# Altium project fitkit4_fpga.PrjPcb
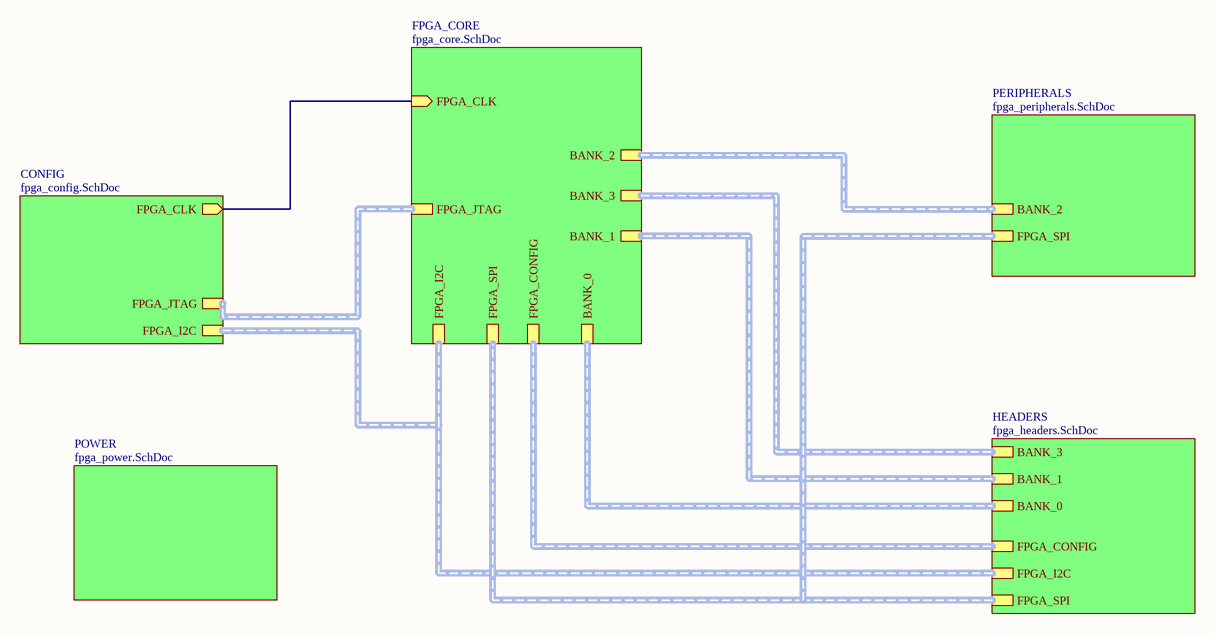
[diagram p0: fpga_board.SchDoc]
6 sheets, 79 parts. Net scope: hierarchical (ports join the sheet entries above them; power ports are global).
Board file: fpga_board.PcbDoc
Sheets:
  fpga_board.SchDoc
    FPGA_CORE = fpga_core.SchDoc
    POWER = fpga_power.SchDoc
    CONFIG = fpga_config.SchDoc
    PERIPHERALS = fpga_peripherals.SchDoc
    HEADERS = fpga_headers.SchDoc

## Sheet fpga_board.SchDoc
size A4

### Sub-sheets
CONFIG = fpga_config.SchDoc: FPGA_JTAG (harness FPGA_JTAG), FPGA_I2C (harness FPGA_I2C), FPGA_CLK (out)
FPGA_CORE = fpga_core.SchDoc: BANK_2 (harness BANK_2), BANK_3 (harness BANK_3), BANK_1 (harness BANK_1), BANK_0 (harness BANK_0), FPGA_I2C (harness FPGA_I2C), FPGA_SPI (harness FPGA_SPI), FPGA_JTAG (harness FPGA_JTAG), FPGA_CONFIG (harness FPGA_CONFIG), FPGA_CLK (in)
HEADERS = fpga_headers.SchDoc: FPGA_I2C (harness FPGA_I2C), BANK_1 (harness BANK_1), FPGA_SPI (harness FPGA_SPI), BANK_3, FPGA_CONFIG, BANK_0
PERIPHERALS = fpga_peripherals.SchDoc: FPGA_SPI, BANK_2
POWER = fpga_power.SchDoc: no entries

### Nets
PT23A: sheet FPGA_CORE/FPGA_CLK, sheet CONFIG/FPGA_CLK

### Buses and harness runs
harness sheet CONFIG/FPGA_I2C = sheet FPGA_CORE/FPGA_I2C = sheet HEADERS/FPGA_I2C
harness sheet CONFIG/FPGA_JTAG = sheet FPGA_CORE/FPGA_JTAG
harness sheet FPGA_CORE/BANK_0 = sheet HEADERS/BANK_0
harness sheet FPGA_CORE/BANK_1 = sheet HEADERS/BANK_1
harness sheet FPGA_CORE/BANK_2 = sheet PERIPHERALS/BANK_2
harness sheet FPGA_CORE/BANK_3 = sheet HEADERS/BANK_3
harness sheet FPGA_CORE/FPGA_CONFIG = sheet HEADERS/FPGA_CONFIG
harness sheet FPGA_CORE/FPGA_SPI = sheet HEADERS/FPGA_SPI = sheet PERIPHERALS/FPGA_SPI

## Sheet fpga_core.SchDoc
size A4
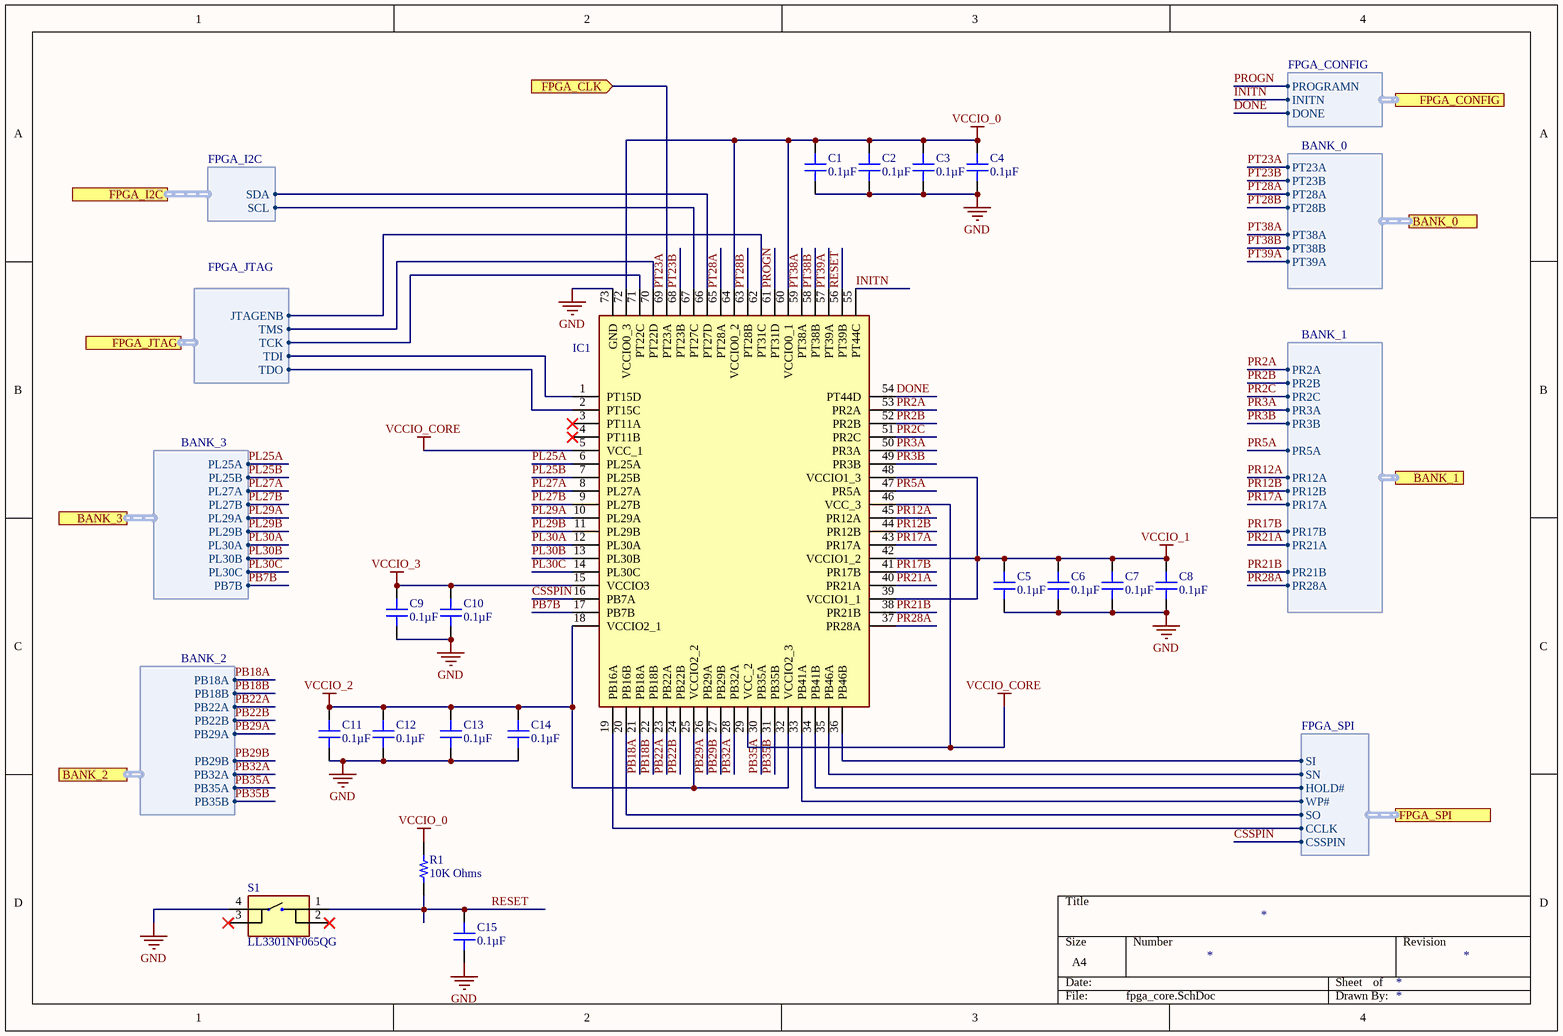
[diagram p1: fpga_core.SchDoc]

### Parts
C1  0.1µF  [CAP 0603_1608]
C2  0.1µF  [CAP 0603_1608]
C3  0.1µF  [CAP 0603_1608]
C4  0.1µF  [CAP 0603_1608]
C5  0.1µF  [CAP 0603_1608]
C6  0.1µF  [CAP 0603_1608]
C7  0.1µF  [CAP 0603_1608]
C8  0.1µF  [CAP 0603_1608]
C9  0.1µF  [CAP 0603_1608]
C10  0.1µF  [CAP 0603_1608]
C11  0.1µF  [CAP 0603_1608]
C12  0.1µF  [CAP 0603_1608]
C13  0.1µF  [CAP 0603_1608]
C14  0.1µF  [CAP 0603_1608]
C15  0.1µF  [CAP 0603_1608]
IC1  LCMXO3D-9400HC-6SG72C  [QFN50P1000X1000X90-73N-D]  (value not drawn)
R1  10K Ohms  [RES 0603_1608]
S1  LL3301NF065QG  [LL3301NF065QG]

### Ports
BANK_0 (harness BANK_0), BANK_1 (harness BANK_1), BANK_2 (harness BANK_2), BANK_3 (harness BANK_3), FPGA_CLK (in), FPGA_CONFIG (harness FPGA_CONFIG), FPGA_I2C (harness FPGA_I2C), FPGA_JTAG (harness FPGA_JTAG), FPGA_SPI (harness FPGA_SPI)

### Harnesses
BANK_3: PB7B, PL30C, PL30B, PL30A, PL29B, PL29A, PL27B, PL27A, PL25B, PL25A
BANK_1: PR2A, PR2B, PR2C, PR3A, PR3B, PR5A, PR12A, PR12B, PR17A, PR17B, PR21A, PR21B, PR28A
BANK_0: PT23A, PT23B, PT28A, PT28B, PT38A, PT38B, PT39A
BANK_2: PB35B, PB35A, PB32A, PB29B, PB29A, PB22B, PB22A, PB18B, PB18A
FPGA_SPI: SI, SN, SO, CCLK, CSSPIN, HOLD#, WP#
FPGA_I2C: SDA, SCL
FPGA_JTAG: JTAGENB, TMS, TCK, TDI, TDO
FPGA_CONFIG: PROGRAMN, INITN, DONE

### Nets
GND: C1.1 C2.1 C3.1 C4.1 C5.1 C6.1 C7.1 C8.1 C9.1 C10.1 C11.1 C12.1 C13.1 C14.1 C15.1 IC1.73(GND) S1.4
VCCIO_0: C1.2 C2.2 C3.2 C4.2 IC1.60(VCCIO0_1) IC1.64(VCCIO0_2) IC1.72(VCCIO0_3) R1.2
VCCIO_1: C5.2 C6.2 C7.2 C8.2 IC1.39(VCCIO1_1) IC1.42(VCCIO1_2) IC1.48(VCCIO1_3)
VCCIO_2: C11.2 C12.2 C13.2 C14.2 IC1.18(VCCIO2_1) IC1.25(VCCIO2_2) IC1.32(VCCIO2_3)
VCCIO_3: C9.2 C10.2 IC1.15(VCCIO3)
VCCIO_CORE: IC1.5(VCC_1) IC1.29(VCC_2) IC1.46(VCC_3)
CSSPIN: IC1.16(PB7A) ; port FPGA_SPI.CSSPIN
DONE: IC1.54(PT44D) ; port FPGA_CONFIG.DONE
INITN: IC1.55(PT44C) ; port FPGA_CONFIG.INITN
PB7B: IC1.17(PB7B) ; port BANK_3.PB7B
PB18A: IC1.21(PB18A) ; port BANK_2.PB18A
PB18B: IC1.22(PB18B) ; port BANK_2.PB18B
PB22A: IC1.23(PB22A) ; port BANK_2.PB22A
PB22B: IC1.24(PB22B) ; port BANK_2.PB22B
PB29A: IC1.26(PB29A) ; port BANK_2.PB29A
PB29B: IC1.27(PB29B) ; port BANK_2.PB29B
PB32A: IC1.28(PB32A) ; port BANK_2.PB32A
PB35A: IC1.30(PB35A) ; port BANK_2.PB35A
PB35B: IC1.31(PB35B) ; port BANK_2.PB35B
PL25A: IC1.6(PL25A) ; port BANK_3.PL25A
PL25B: IC1.7(PL25B) ; port BANK_3.PL25B
PL27A: IC1.8(PL27A) ; port BANK_3.PL27A
PL27B: IC1.9(PL27B) ; port BANK_3.PL27B
PL29A: IC1.10(PL29A) ; port BANK_3.PL29A
PL29B: IC1.11(PL29B) ; port BANK_3.PL29B
PL30A: IC1.12(PL30A) ; port BANK_3.PL30A
PL30B: IC1.13(PL30B) ; port BANK_3.PL30B
PL30C: IC1.14(PL30C) ; port BANK_3.PL30C
PR2A: IC1.53(PR2A) ; port BANK_1.PR2A
PR2B: IC1.52(PR2B) ; port BANK_1.PR2B
PR2C: IC1.51(PR2C) ; port BANK_1.PR2C
PR3A: IC1.50(PR3A) ; port BANK_1.PR3A
PR3B: IC1.49(PR3B) ; port BANK_1.PR3B
PR5A: IC1.47(PR5A) ; port BANK_1.PR5A
PR12A: IC1.45(PR12A) ; port BANK_1.PR12A
PR12B: IC1.44(PR12B) ; port BANK_1.PR12B
PR17A: IC1.43(PR17A) ; port BANK_1.PR17A
PR17B: IC1.41(PR17B) ; port BANK_1.PR17B
PR21A: IC1.40(PR21A) ; port BANK_1.PR21A
PR21B: IC1.38(PR21B) ; port BANK_1.PR21B
PR28A: IC1.37(PR28A) ; port BANK_1.PR28A
PROGN: IC1.61(PT31D) ; port FPGA_CONFIG.PROGRAMN
PT23A: IC1.69(PT23A) ; port FPGA_CLK, port BANK_0.PT23A
PT23B: IC1.68(PT23B) ; port BANK_0.PT23B
PT28A: IC1.65(PT28A) ; port BANK_0.PT28A
PT28B: IC1.63(PT28B) ; port BANK_0.PT28B
PT38A: IC1.59(PT38A) ; port BANK_0.PT38A
PT38B: IC1.58(PT38B) ; port BANK_0.PT38B
PT39A: IC1.57(PT39A) ; port BANK_0.PT39A
RESET: C15.2 IC1.56(PT39B) R1.1 S1.1
NetIC1_1: IC1.1(PT15D) ; port FPGA_JTAG.TDI
NetIC1_2: IC1.2(PT15C) ; port FPGA_JTAG.TDO
NetIC1_19: IC1.19(PB16A) ; port FPGA_SPI.CCLK
NetIC1_20: IC1.20(PB16B) ; port FPGA_SPI.SO
NetIC1_33: IC1.33(PB41A) ; port FPGA_SPI.WP#
NetIC1_34: IC1.34(PB41B) ; port FPGA_SPI.HOLD#
NetIC1_35: IC1.35(PB46A) ; port FPGA_SPI.SN
NetIC1_36: IC1.36(PB46B) ; port FPGA_SPI.SI
NetIC1_62: IC1.62(PT31C) ; port FPGA_JTAG.JTAGENB
NetIC1_66: IC1.66(PT27D) ; port FPGA_I2C.SDA
NetIC1_67: IC1.67(PT27C) ; port FPGA_I2C.SCL
NetIC1_70: IC1.70(PT22D) ; port FPGA_JTAG.TMS
NetIC1_71: IC1.71(PT22C) ; port FPGA_JTAG.TCK

Not connected (* = marked no-connect by the designer): IC1 3(PT11A)* 4(PT11B)*; S1 2* 3*

### Library data of the parts
C1-C15 = CS0603KRX7R7BB104: CAP CER 0.1UF 16V X7R 0603; Manufacturer: Yageo; Tolerance: ±10%; Part Number: CS0603KRX7R7BB104; Value: 0.1µF; Applications: Boardflex Sensitive; Capacitance: 0.1µF; ComponentLink1Description: Datasheet; ComponentLink1URL: http://www.yageo.com/NewPortal/yageodocoutput?fileName=/pdf/MLCC/UPY-ST_NPOX7R_16V-to-3KV_5.pdf; ComponentLink2Description: DigiKey Link; ComponentLink2URL: http://digikey.com/product-detail/en/yageo/CS0603KRX7R7BB104/311-3560-1-ND/7648487; Device Package: 0603 (1608 Metric); Features: Soft Termination; LastUpdated: 02.09.2020 1:03:36; Lifecycle Status: Active; Minimum Order: 1; Mounting Type: Surface Mount, MLCC; Operating Temperature: -55°C ~ 125°C; Package / Case: 0603 (1608 Metric); Packaging: TapeAndReel; PartId: 2286; Part Status: Active; Price: 0.02; Series: CS; Size / Dimension: 0.063" L x 0.031" W (1.60mm x 0.80mm); Supplier 1: DigiKey; Supplier Part Number 1: 311-3560-1-ND; Temperature Coefficient: X7R; Thickness (Max): 0.037" (0.95mm); Voltage - Rated: 16V
IC1 = LCMXO3D-9400HC-6SG72C: Integrated Circuit; Manufacturer_Name: Lattice Semiconductor; Datasheet Link: http://www.latticesemi.com/Products/FPGAandCPLD/MachXO3D; Height: 0.9mm; Manufacturer_Part_Number: LCMXO3D-9400HC-6SG72C; Mouser Part Number: 842-O3D9400HC6SG72C; Mouser Price/Stock: https://www.mouser.co.uk/ProductDetail/Lattice/LCMXO3D-9400HC-6SG72C?qs=P1JMDcb91o5zlo%2FfseWNjQ%3D%3D
R1 = CRCW0603470RJNEAHP: RES SMD 470 OHM 5% 1/4W 0603; Manufacturer: Vishay Dale; Power (Watts): 0.25W, 1/4W; Resistance: 470 Ohms; Temperature Coefficient: ±200ppm/°C; Part Number: CRCW0603470RJNEAHP; Value: 10K Ohms; ComponentLink1Description: Datasheet; ComponentLink1URL: http://www.vishay.com/docs/20043/crcwhpe3.pdf; ComponentLink2Description: DigiKey Link; ComponentLink2URL: http://digikey.com/product-detail/en/vishay-dale/CRCW0603470RJNEAHP/541-470SACT-ND/2222809; Composition: Thick Film; Device Package: 0603 (1608 Metric); Features: Automotive AEC-Q200, Pulse Withstanding; Height - Seated (Max): 0.022" (0.55mm); LastUpdated: 02.09.2020 1:09:49; Lifecycle Status: Active; Minimum Order: 1; Number of Terminations: 2; Operating Temperature: -55°C ~ 155°C; Package / Case: 0603 (1608 Metric); Packaging: TapeAndReel; PartId: 21320; Part Status: Active; Price: 0.02; Ratings: AEC-Q200; Series: CRCW-HP; Size / Dimension: 0.063" L x 0.033" W (1.60mm x 0.85mm); Supplier Device Package: 0603; Tolerance: ±5%; Supplier 1: Farnell; Supplier Part Number 1: 3495224
S1 = LL3301NF065QG: Switch; Manufacturer_Name: E-Switch; Datasheet Link: http://spec_sheets.e-switch.com/specs/P090002.pdf; Height: 4mm; Manufacturer_Part_Number: LL3301NF065QG; Mouser Part Number: 612-LL3301NF065QG; Mouser Price/Stock: https://www.mouser.co.uk/ProductDetail/E-Switch/LL3301NF065QG/?qs=QtyuwXswaQiWhwgY68YTTw%3D%3D

## Sheet fpga_power.SchDoc
size A4
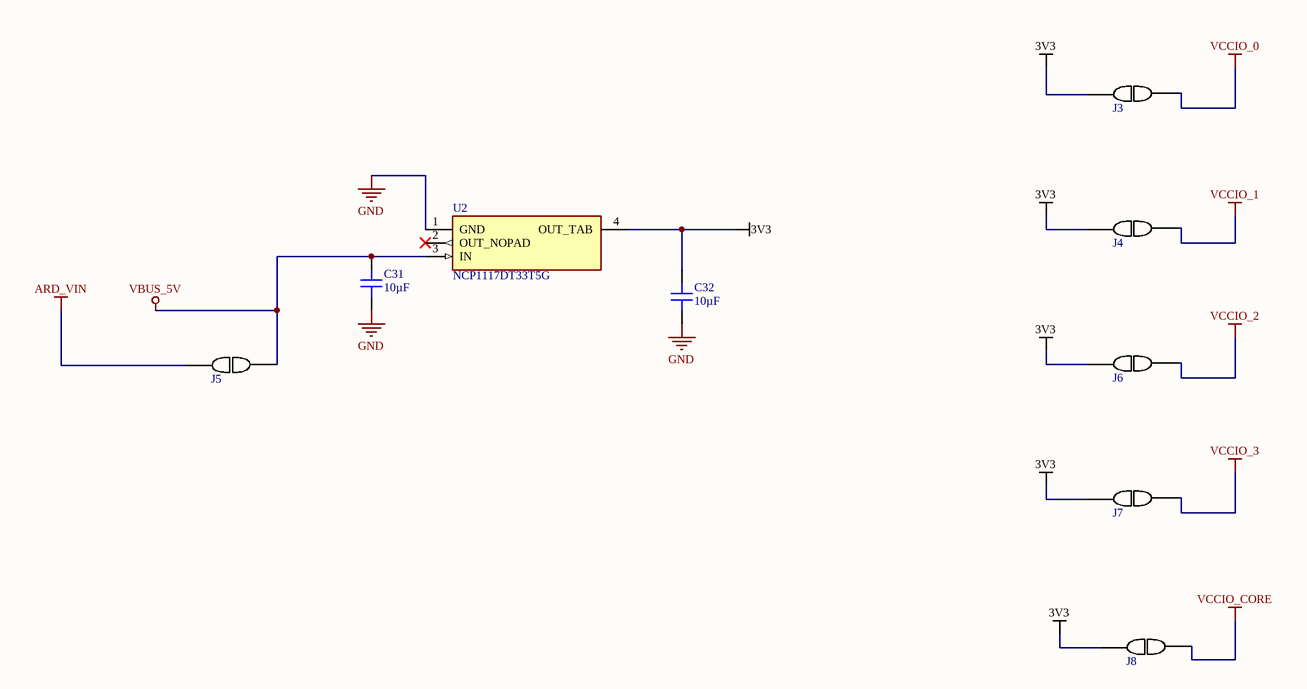
[diagram p2: fpga_power.SchDoc]

### Parts
C31  10µF  [CAP 0603_1608]
C32  10µF  [CAP 0603_1608]
J3  103185-2  [TE_103185-2]  (value not drawn)
J4  103185-2  [TE_103185-2]  (value not drawn)
J5  103185-2  [TE_103185-2]  (value not drawn)
J6  103185-2  [TE_103185-2]  (value not drawn)
J7  103185-2  [TE_103185-2]  (value not drawn)
J8  103185-2  [TE_103185-2]  (value not drawn)
U2  NCP1117DT33T5G  [TO229P990X238-4N]

### Nets
3V3: C32.1 J3.1 J4.1 J6.1 J7.1 J8.1 U2.4(OUT_TAB)
ARD_VIN: J5.2
GND: C31.1 C32.2 U2.1(GND)
VBUS_5V: C31.2 J5.1 U2.3(IN)
VCCIO_0: J3.2
VCCIO_1: J4.2
VCCIO_2: J6.2
VCCIO_3: J7.2
VCCIO_CORE: J8.2

Not connected (* = marked no-connect by the designer): U2 2(OUT_NOPAD)*

### Library data of the parts
C31 C32 = GRT188R61C106KE13D: CAP CER 10UF 16V X5R 0603; Manufacturer: Murata Electronics; Tolerance: ±10%; Part Number: GRT188R61C106KE13D; Value: 10µF; Applications: Automotive; Capacitance: 10µF; ComponentLink1Description: Datasheet; ComponentLink1URL: https://search.murata.co.jp/Ceramy/image/img/A01X/G101/ENG/GRT188R61C106KE13-01.pdf; ComponentLink2Description: DigiKey Link; ComponentLink2URL: http://digikey.com/product-detail/en/murata-electronics/GRT188R61C106KE13D/490-12317-1-ND/5417018; Device Package: 0603 (1608 Metric); LastUpdated: 02.09.2020 1:03:11; Lifecycle Status: Active; Minimum Order: 1; Mounting Type: Surface Mount, MLCC; Operating Temperature: -55°C ~ 85°C; Package / Case: 0603 (1608 Metric); Packaging: TapeAndReel; PartId: 14922; Part Status: Active; Price: 0.10; Ratings: AEC-Q200; Series: GRT; Size / Dimension: 0.063" L x 0.031" W (1.60mm x 0.80mm); Supplier 1: DigiKey; Supplier Part Number 1: 490-12317-1-ND; Temperature Coefficient: X5R; Thickness (Max): 0.035" (0.90mm); Voltage - Rated: 16V
J3-J8 = 103185-2: 02 MODII HDR SRST B/A .100CL; Package: None; Price: None; Value: *; MP: 103185-2; Availability: Unavailable
U2 = NCP1117DT33T5G: Integrated Circuit; Manufacturer_Name: ON Semiconductor; Datasheet Link: http://www.onsemi.com/pub/Collateral/NCP1117-D.PDF; Height: 2.38mm; Manufacturer_Part_Number: NCP1117DT33T5G; Mouser Part Number: 863-NCP1117DT33T5G; Mouser Price/Stock: https://www.mouser.co.uk/ProductDetail/ON-Semiconductor/NCP1117DT33T5G/?qs=Gev%252BmEvV0ibY9yFNc3ZYyw%3D%3D; Arrow Part Number: NCP1117DT33T5G; Arrow Price/Stock: https://www.arrow.com/en/products/ncp1117dt33t5g/on-semiconductor

## Sheet fpga_config.SchDoc
size A4
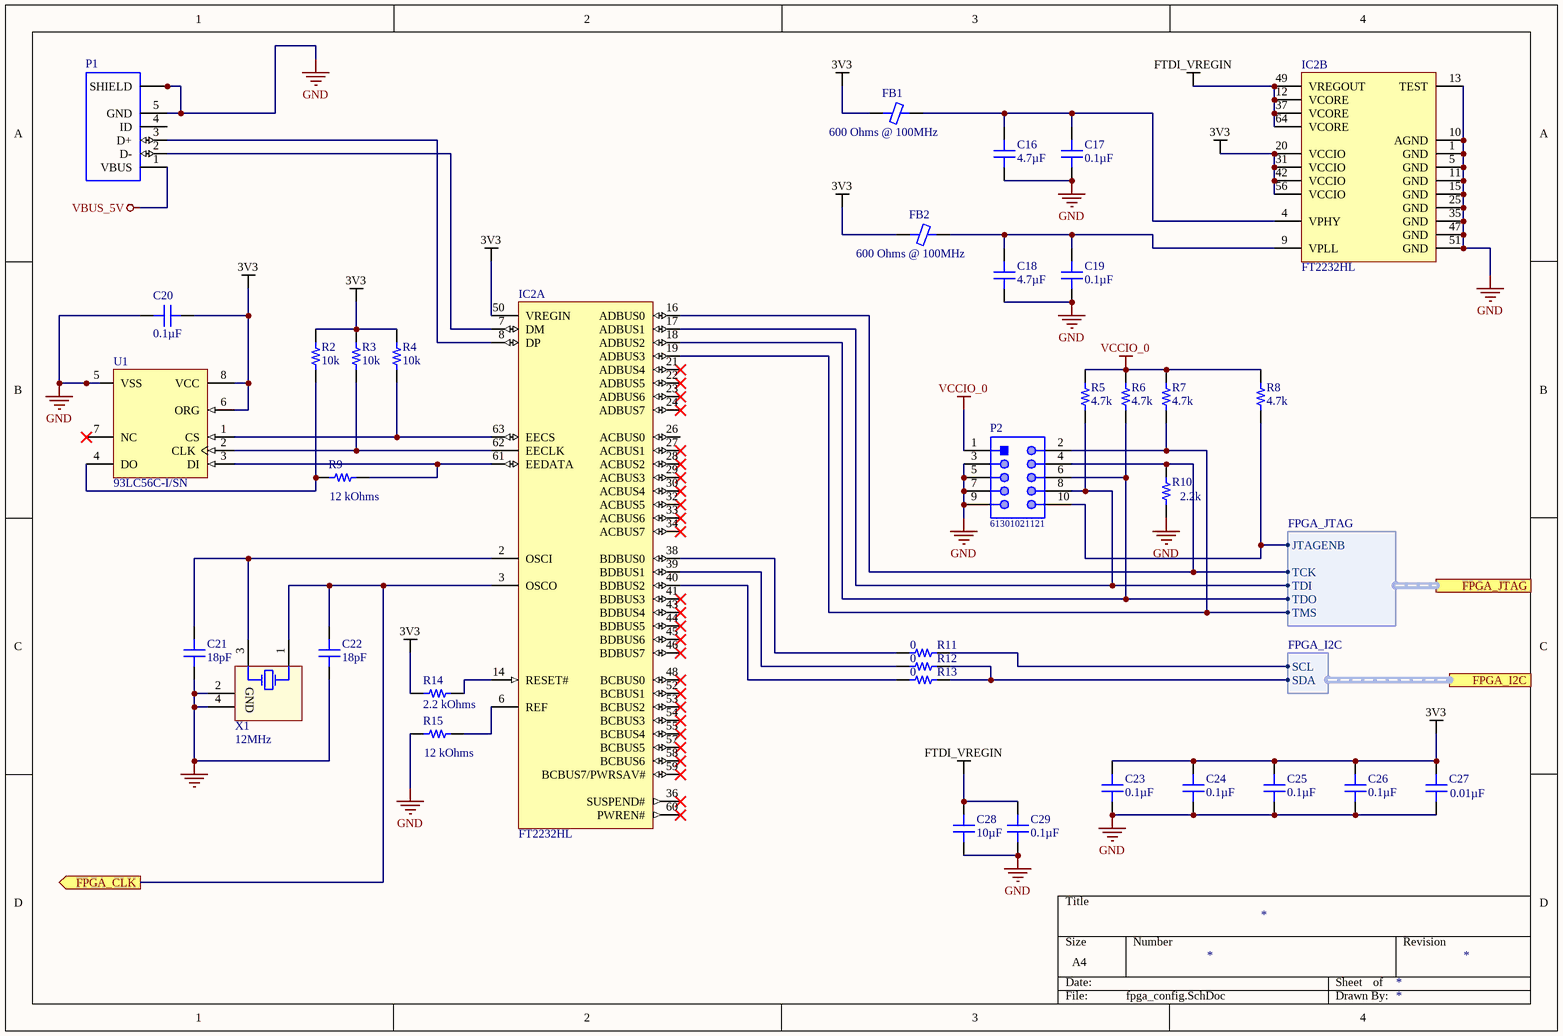
[diagram p3: fpga_config.SchDoc]

### Parts
C16  4.7µF  [CAP 0603_1608]
C17  0.1µF  [CAP 0603_1608]
C18  4.7µF  [CAP 0603_1608]
C19  0.1µF  [CAP 0603_1608]
C20  0.1µF  [CAP 0603_1608]
C21  18pF  [CAP 0603_1608]
C22  18pF  [CAP 0603_1608]
C23  0.1µF  [CAP 0603_1608]
C24  0.1µF  [CAP 0603_1608]
C25  0.1µF  [CAP 0603_1608]
C26  0.1µF  [CAP 0603_1608]
C27  0.01µF  [CAP 0603_1608]
C28  10µF  [CAP 0603_1608]
C29  0.1µF  [CAP 0603_1608]
FB1  600 Ohms @ 100MHz  [FER 0603_1608]
FB2  600 Ohms @ 100MHz  [FER 0603_1608]
IC2  FT2232HL  [FTDI-LQFP-64_L]  (parts A,B of 2)
P1  47346-0001  [MOLEX_47346-0001]  (value not drawn)
P2  61301021121  [61301021121]
R2  10k  [RES 0603_1608]
R3  10k  [RES 0603_1608]
R4  10k  [RES 0603_1608]
R5  4.7k  [RES 0603_1608]
R6  4.7k  [RES 0603_1608]
R7  4.7k  [RES 0603_1608]
R8  4.7k  [RES 0603_1608]
R9  12 kOhms  [RES 0603_1608]
R10  2.2k  [RES 0603_1608]
R11  0  [RES 0603_1608]
R12  0  [RES 0603_1608]
R13  0  [RES 0603_1608]
R14  2.2 kOhms  [RES 0603_1608]
R15  12 kOhms  [RES 0603_1608]
U1  93LC56C-I/SN  [SOIC-SN8_L]
X1  12MHz  [ABRA-ABMM2-4_V]

### Ports
FPGA_CLK (out), FPGA_I2C (harness FPGA_I2C), FPGA_JTAG (harness FPGA_JTAG)

### Harnesses
FPGA_JTAG: JTAGENB, TCK, TDI, TDO, TMS
FPGA_I2C: SCL, SDA

### Nets
3V3: C20.1 C23.2 C24.2 C25.2 C26.2 C27.2 FB1.1 FB2.1 IC2.20(VCCIO) IC2.31(VCCIO) IC2.42(VCCIO) IC2.50(VREGIN) IC2.56(VCCIO) R2.2 R3.2 R4.2 R14.1 U1.6(ORG) U1.8(VCC)
FTDI_VREGIN: C28.2 C29.2 IC2.12(VCORE) IC2.37(VCORE) IC2.49(VREGOUT) IC2.64(VCORE)
GND: C16.1 C17.1 C18.1 C19.1 C20.2 C21.1 C22.1 C23.1 C24.1 C25.1 C26.1 C27.1 C28.1 C29.1 IC2.1(GND) IC2.5(GND) IC2.10(AGND) IC2.11(GND) IC2.13(TEST) IC2.15(GND) IC2.25(GND) IC2.35(GND) IC2.47(GND) IC2.51(GND) P1.5(GND) P1.SH1(SHIELD) P1.SH2(SHIELD) P1.SH3(SHIELD) P1.SH4(SHIELD) P1.SH5(SHIELD) P1.SH6(SHIELD) P2.3 P2.5 P2.7 P2.9 R10.1 R15.1 U1.5(VSS) X1.2(GND) X1.4(GND)
VBUS_5V: P1.1(VBUS)
VCCIO_0: P2.1 R5.2 R6.2 R7.2 R8.2
PT23A: C22.2 IC2.3(OSCO) X1.1(X1) ; port FPGA_CLK
NetC16_2: C16.2 C17.2 FB1.2 IC2.4(VPHY)
NetC18_2: C18.2 C19.2 FB2.2 IC2.9(VPLL)
NetC21_2: C21.2 IC2.2(OSCI) X1.3(X2)
NetIC1_1: IC2.17(ADBUS1) P2.8 R5.1 ; port FPGA_JTAG.TDI
NetIC1_2: IC2.18(ADBUS2) P2.6 R6.1 ; port FPGA_JTAG.TDO
NetIC1_62: P2.10 R8.1 ; port FPGA_JTAG.JTAGENB
NetIC1_66: R12.2 R13.2 ; port FPGA_I2C.SDA
NetIC1_67: R11.2 ; port FPGA_I2C.SCL
NetIC1_70: IC2.19(ADBUS3) P2.2 R7.1 ; port FPGA_JTAG.TMS
NetIC1_71: IC2.16(ADBUS0) P2.4 R10.2 ; port FPGA_JTAG.TCK
NetIC2_6: IC2.6(REF) R15.2
NetIC2_7: IC2.7(DM) P1.2(D-)
NetIC2_8: IC2.8(DP) P1.3(D+)
NetIC2_14: IC2.14(RESET#) R14.2
NetIC2_38: IC2.38(BDBUS0) R11.1
NetIC2_39: IC2.39(BDBUS1) R12.1
NetIC2_40: IC2.40(BDBUS2) R13.1
NetIC2_61: IC2.61(EEDATA) R9.2 U1.3(DI)
NetIC2_62: IC2.62(EECLK) R3.1 U1.2(CLK)
NetIC2_63: IC2.63(EECS) R4.1 U1.1(CS)
NetR2_1: R2.1 R9.1 U1.4(DO)

Not connected (* = marked no-connect by the designer): IC2 21(ADBUS4)* 22(ADBUS5)* 23(ADBUS6)* 24(ADBUS7)* 26(ACBUS0) 27(ACBUS1)* 28(ACBUS2)* 29(ACBUS3)* 30(ACBUS4)* 32(ACBUS5)* 33(ACBUS6)* 34(ACBUS7)* 36(SUSPEND#)* 41(BDBUS3)* 43(BDBUS4)* 44(BDBUS5)* 45(BDBUS6)* 46(BDBUS7)* 48(BCBUS0)* 52(BCBUS1)* 53(BCBUS2)* 54(BCBUS3)* 55(BCBUS4)* 57(BCBUS5)* 58(BCBUS6)* 59(BCBUS7/PWRSAV#)* 60(PWREN#)*; P1 4(ID); U1 7(NC)*

### Library data of the parts
C16 C18 = LMK107BJ475KA-T: CAP CER 4.7UF 10V X5R 0603; Manufacturer: Taiyo Yuden; Tolerance: ±10%; Part Number: LMK107BJ475KA-T; Value: 4.7µF; Applications: General Purpose; Capacitance: 4.7µF; ComponentLink1Description: Datasheet; ComponentLink1URL: https://ds.yuden.co.jp/TYCOMPAS/ut/detail?pn=LMK107BJ475KA-T  &u=M; ComponentLink2Description: DigiKey Link; ComponentLink2URL: http://digikey.com/product-detail/en/taiyo-yuden/LMK107BJ475KA-T/587-1441-1-ND/1004072; Device Package: 0603 (1608 Metric); LastUpdated: 02.09.2020 1:03:36; Lifecycle Status: Active; Minimum Order: 1; Mounting Type: Surface Mount, MLCC; Operating Temperature: -55°C ~ 85°C; Package / Case: 0603 (1608 Metric); Packaging: TapeAndReel; PartId: 2244; Part Status: Active; Price: 0.03; Series: M; Size / Dimension: 0.063" L x 0.031" W (1.60mm x 0.80mm); Supplier 1: DigiKey; Supplier Part Number 1: 587-1441-1-ND; Temperature Coefficient: X5R; Thickness (Max): 0.035" (0.90mm); Voltage - Rated: 10V
C17 C19 C20 C23-C26 C29 = C0603C104K5RAC7411: CAP CER 0.1UF 50V X7R 0603; Manufacturer: KEMET; Tolerance: ±10%; Part Number: C0603C104K5RAC7411; Value: 0.1µF; Applications: Bypass, Decoupling; Capacitance: 0.1µF; ComponentLink1Description: Datasheet; ComponentLink1URL: https://api.kemet.com/component-edge/download/datasheet/C0603C104K5RAC7411.pdf; ComponentLink2Description: DigiKey Link; ComponentLink2URL: http://digikey.com/product-detail/en/kemet/C0603C104K5RAC7411/399-7374-2-ND/3317013; Device Package: 0603 (1608 Metric); LastUpdated: 02.09.2020 1:03:36; Lifecycle Status: Active; Minimum Order: 15000; Mounting Type: Surface Mount, MLCC; Operating Temperature: -55°C ~ 125°C; Package / Case: 0603 (1608 Metric); Packaging: TapeAndReel; PartId: 2233; Part Status: Active; Price: 0.02; Series: SMD Comm X7R; Size / Dimension: 0.063" L x 0.031" W (1.60mm x 0.80mm); Supplier 1: DigiKey; Supplier Part Number 1: 399-7374-2-ND; Temperature Coefficient: X7R; Thickness (Max): 0.035" (0.90mm); Voltage - Rated: 50V
C21 C22 = VJ0603A180FXQCW1BC: CAP CER 18PF 10V C0G/NP0 0603; Manufacturer: Vishay Vitramon; Temperature Coefficient: C0G, NP0; Tolerance: ±1%; Part Number: VJ0603A180FXQCW1BC; Value: 18pF; Applications: General Purpose; Capacitance: 18pF; ComponentLink1Description: Datasheet; ComponentLink1URL: https://www.vishay.com/docs/28548/vjw1bcbascomseries.pdf; ComponentLink2Description: DigiKey Link; ComponentLink2URL: http://digikey.com/product-detail/en/vishay-vitramon/VJ0603A180FXQCW1BC/720-1660-1-ND/8324080; Device Package: 0603 (1608 Metric); LastUpdated: 02.09.2020 1:03:27; Lifecycle Status: Active; Minimum Order: 1; Mounting Type: Surface Mount, MLCC; Operating Temperature: -55°C ~ 125°C; Package / Case: 0603 (1608 Metric); Packaging: TapeAndReel; PartId: 7094; Part Status: Active; Price: 0.04; Series: VJ; Size / Dimension: 0.063" L x 0.031" W (1.60mm x 0.80mm); Supplier 1: DigiKey; Supplier Part Number 1: 720-1660-1-ND; Thickness (Max): 0.034" (0.87mm); Voltage - Rated: 10V
C27 = C0603C103KARACAUTO: CAP CER 0.01UF 250V X7R 0603; Manufacturer: KEMET; Tolerance: ±10%; Part Number: C0603C103KARACAUTO; Value: 0.01µF; Applications: Automotive, Bypass, Decoupling; Capacitance: 0.01µF; ComponentLink1Description: Datasheet; ComponentLink1URL: https://api.kemet.com/component-edge/download/datasheet/C0603C103KARACAUTO.pdf; ComponentLink2Description: DigiKey Link; ComponentLink2URL: http://digikey.com/product-detail/en/kemet/C0603C103KARACAUTO/399-17960-1-ND/9084030; Device Package: 0603 (1608 Metric); LastUpdated: 02.09.2020 1:03:10; Lifecycle Status: Active; Minimum Order: 1; Mounting Type: Surface Mount, MLCC; Operating Temperature: -55°C ~ 125°C; Package / Case: 0603 (1608 Metric); Packaging: TapeAndReel; PartId: 15195; Part Status: Active; Price: 0.25; Ratings: AEC-Q200; Series: SMD Auto X7R; Size / Dimension: 0.063" L x 0.031" W (1.60mm x 0.80mm); Supplier 1: DigiKey; Supplier Part Number 1: 399-17960-1-ND; Temperature Coefficient: X7R; Thickness (Max): 0.034" (0.87mm); Voltage - Rated: 250V
C28 = GRM188R60J106ME47D: CAP CER 10UF 6.3V X5R 0603; Manufacturer: Murata Electronics; Tolerance: ±20%; Part Number: GRM188R60J106ME47D; Value: 10µF; Applications: General Purpose; Capacitance: 10µF; ComponentLink1Description: Datasheet; ComponentLink1URL: https://www.murata.com/~/media/webrenewal/support/library/catalog/products/capacitor/mlcc/c02e.ashx?la=en-us; ComponentLink2Description: DigiKey Link; ComponentLink2URL: http://digikey.com/product-detail/en/murata-electronics/GRM188R60J106ME47D/490-3896-1-ND/965938; Device Package: 0603 (1608 Metric); LastUpdated: 02.09.2020 1:03:35; Lifecycle Status: Active; Minimum Order: 1; Mounting Type: Surface Mount, MLCC; Operating Temperature: -55°C ~ 85°C; Package / Case: 0603 (1608 Metric); Packaging: TapeAndReel; PartId: 2351; Part Status: Active; Price: 0.03; Series: GRM; Size / Dimension: 0.063" L x 0.031" W (1.60mm x 0.80mm); Supplier 1: DigiKey; Supplier Part Number 1: 490-3896-1-ND; Temperature Coefficient: X5R; Thickness (Max): 0.035" (0.90mm); Voltage - Rated: 6.3V
FB1 FB2 = BLM18AG601SN1D: FERRITE BEAD 600 OHM 0603 1LN; Manufacturer: Murata Electronics; Current Rating (Max): 500mA; DC Resistance (DCR) (Max): 380mOhm; Number of Lines: 1; Part Number: BLM18AG601SN1D; ComponentLink1Description: Datasheet; ComponentLink1URL: https://www.murata.com/en-us/products/productdata/8796738650142/ENFA0003.pdf; ComponentLink2Description: DigiKey Link; ComponentLink2URL: http://digikey.com/product-detail/en/murata-electronics/BLM18AG601SN1D/490-1014-1-ND/584462; Device Package: 0603 (1608 Metric); Height (Max): 0.037" (0.95mm); Impedance @ Frequency: 600 Ohms @ 100MHz; LastUpdated: 02.09.2020 1:18:18; Lifecycle Status: Active; Minimum Order: 1; Mounting Type: Surface Mount; Operating Temperature: -55°C ~ 125°C; Package / Case: 0603 (1608 Metric); Packaging: TapeAndReel; PartId: 848; Part Status: Active; Price: 0.02; Series: EMIFIL®, BLM18; Size / Dimension: 0.063" L x 0.032" W (1.60mm x 0.80mm); Supplier 1: DigiKey; Supplier Part Number 1: 490-1014-1-ND; Value: 600 Ohms @ 100MHz
IC2 = CMP-2000-06287-1: Dual High Speed USB to Multipurpose UART / FIFO IC / , 3 to 3.6 V, -40 to 85 degC, 64- Pin LQFP, RoHS; Manufacturer: FTDI; Number of Channels per Chip: 2; Standard Supported: RS232,RS422,RS485; Maximum Data Rate: 480Mbit/s; Package Description: 64-Pin Low-profile Quad Flat Package, Body 10 x 10 mm, Pitch 0.5 mm; Maximum Operating Temperature: +85°C; Mounting Technology: SurfaceMount; Pin Count: 64; Package Reference: LQFP-64; Manufacturer URL: http://www.nxp.com/; Length: 10mm; Width: 10mm; Minimum Operating Temperature: -40°C; Dimensions: 10x10x1.4mm; Package Type: LQFP; Mounting Type: SurfaceMount; Datasheet URL: http://www.ftdichip.com/Support/Documents/DataSheets/ICs/DS_FT2232H.pdf; Datasheet Version: Rev. 2.5, 07/2016; Height: 1.4mm
P1 = 47346-0001: CONN RCPT 5POS MICRO USB R/A  SMD; Value: *; Supplier 1: Farnell; Supplier Part Number 1: 1568026; Supplier 2: Mouser; Supplier Part Number 2: 538-47346-0001
P2 = CMP-1502-01084-1: THT Vertical Pin Header WR-PHD, Pitch 2.54 mm, Dual Row, 10 pins; Manufacturer: Wurth Elektronik; Working Voltage: 250VAC; Pitch: 2.54mm; Contact Resistance: 20mOhm; Gender: Male; Rated Current: 3A; Withstanding Voltage: 500VAC; Pin Number: 10; Operating Temperature: -40to105degC; Mounting Technology: THT; Publisher: WurthElektronik; Manufacturer URL: http://www.we-online.de; Part Number: 61301021121; Row Number: Dual; Packaging: Bag; Orientation: Vertical; Package Reference: 61301021121; Datasheet URL: https://katalog.we-online.de/em/datasheet/6130xx21121.pdf
R2-R4 = RNCS0603BKE10K0: RES 10K OHM 0.1% 1/16W 0603; Manufacturer: Stackpole Electronics Inc; Power (Watts): 0.063W, 1/16W; Resistance: 10 kOhms; Temperature Coefficient: ±25ppm/°C; Part Number: RNCS0603BKE10K0; Value: 10k; ComponentLink1Description: Datasheet; ComponentLink1URL: https://www.seielect.com/catalog/sei-rncs_rnch.pdf; ComponentLink2Description: DigiKey Link; ComponentLink2URL: http://digikey.com/product-detail/en/stackpole-electronics-inc/RNCS0603BKE10K0/RNCS0603BKE10K0CT-ND/1800113; Composition: Thin Film; Device Package: 0603 (1608 Metric); Features: Anti-Corrosive, Automotive AEC-Q200, Moisture Resistant; Height - Seated (Max): 0.022" (0.55mm); LastUpdated: 02.09.2020 1:10:25; Lifecycle Status: Active; Minimum Order: 1; Number of Terminations: 2; Operating Temperature: -55°C ~ 155°C; Package / Case: 0603 (1608 Metric); Packaging: TapeAndReel; PartId: 4838; Part Status: Active; Price: 0.08; Ratings: AEC-Q200; Series: RNCS; Size / Dimension: 0.061" L x 0.031" W (1.55mm x 0.80mm); Supplier 1: DigiKey; Supplier Part Number 1: RNCS0603BKE10K0CT-ND; Supplier Device Package: 0603; Tolerance: ±0.1%
R5-R8 = RT0603FRE074K7L: RES SMD 4.7K OHM 1% 1/10W 0603; Manufacturer: Yageo; Power (Watts): 0.1W, 1/10W; Resistance: 4.7 kOhms; Temperature Coefficient: ±50ppm/°C; Part Number: RT0603FRE074K7L; Value: 4.7k; ComponentLink1Description: Datasheet; ComponentLink1URL: https://www.yageo.com/upload/media/product/productsearch/datasheet/rchip/PYu-RT_1-to-0.01_RoHS_L_11.pdf; ComponentLink2Description: DigiKey Link; ComponentLink2URL: http://digikey.com/product-detail/en/yageo/RT0603FRE074K7L/YAG1238CT-ND/4340591; Composition: Thin Film; Device Package: 0603 (1608 Metric); Height - Seated (Max): 0.022" (0.55mm); LastUpdated: 02.09.2020 1:10:23; Lifecycle Status: Active; Minimum Order: 1; Number of Terminations: 2; Operating Temperature: -55°C ~ 155°C; Package / Case: 0603 (1608 Metric); Packaging: TapeAndReel; PartId: 5678; Part Status: Active; Price: 0.01; Series: RT; Size / Dimension: 0.063" L x 0.031" W (1.60mm x 0.80mm); Supplier 1: DigiKey; Supplier Part Number 1: YAG1238CT-ND; Supplier Device Package: 0603; Tolerance: ±1%
R9 R15 = RMCF0603JT12K0: RES 12K OHM 5% 1/10W 0603; Manufacturer: Stackpole Electronics Inc; Power (Watts): 0.1W, 1/10W; Temperature Coefficient: ±200ppm/°C; Part Number: RMCF0603JT12K0; Value: 12 kOhms; ComponentLink1Description: Datasheet; ComponentLink1URL: https://www.seielect.com/catalog/sei-rmcf_rmcp.pdf; ComponentLink2Description: DigiKey Link; ComponentLink2URL: http://digikey.com/product-detail/en/stackpole-electronics-inc/RMCF0603JT12K0/RMCF0603JT12K0CT-ND/1943192; Composition: Thick Film; Device Package: 0603 (1608 Metric); Features: Automotive AEC-Q200; Height - Seated (Max): 0.022" (0.55mm); LastUpdated: 02.09.2020 1:10:24; Lifecycle Status: Active; Minimum Order: 1; Number of Terminations: 2; Operating Temperature: -55°C ~ 155°C; Package / Case: 0603 (1608 Metric); Packaging: CutTape; PartId: 5166; Part Status: Active; Price: 0.10; Ratings: AEC-Q200; Resistance: 12 kOhms; Series: RMCF; Size / Dimension: 0.061" L x 0.031" W (1.55mm x 0.80mm); Supplier 1: DigiKey; Supplier Part Number 1: RMCF0603JT12K0CT-ND; Supplier Device Package: 0603; Tolerance: ±5%
R10 = ERA-3AEB222V: RES SMD 2.2K OHM 0.1% 1/10W 0603; Manufacturer: Panasonic Electronic Components; Power (Watts): 0.1W, 1/10W; Resistance: 2.2 kOhms; Temperature Coefficient: ±25ppm/°C; Part Number: ERA-3AEB222V; Value: 2.2k; ComponentLink1Description: Datasheet; ComponentLink1URL: https://industrial.panasonic.com/cdbs/www-data/pdf/RDM0000/AOA0000C307.pdf; ComponentLink2Description: DigiKey Link; ComponentLink2URL: http://digikey.com/product-detail/en/panasonic-electronic-components/ERA-3AEB222V/P2.2KDBCT-ND/1466060; Composition: Thin Film; Device Package: 0603 (1608 Metric); Features: Automotive AEC-Q200; Height - Seated (Max): 0.022" (0.55mm); LastUpdated: 02.09.2020 1:10:23; Lifecycle Status: Active; Minimum Order: 1; Number of Terminations: 2; Operating Temperature: -55°C ~ 155°C; Package / Case: 0603 (1608 Metric); Packaging: TapeAndReel; PartId: 5547; Part Status: Active; Price: 0.04; Ratings: AEC-Q200; Series: ERA-3A; Size / Dimension: 0.063" L x 0.031" W (1.60mm x 0.80mm); Supplier 1: DigiKey; Supplier Part Number 1: P2.2KDBCT-ND; Supplier Device Package: 0603; Tolerance: ±0.1%
R11-R13 = TLRZ1JTTD: RES 0 OHM JUMPER 0603; Manufacturer: KOA Speer Electronics, Inc.; Part Number: TLRZ1JTTD; ComponentLink1Description: Datasheet; ComponentLink1URL: http://www.koaspeer.com/catimages/Products/TLRZ/TLRZ.pdf; ComponentLink2Description: DigiKey Link; ComponentLink2URL: http://digikey.com/product-detail/en/koa-speer-electronics-inc/TLRZ1JTTD/2019-TLRZ1JTTDCT-ND/9847537; Composition: Metal Element; Device Package: 0603 (1608 Metric); Features: Automotive AEC-Q200, Current Sense; Height - Seated (Max): 0.022" (0.55mm); LastUpdated: 02.09.2020 1:10:25; Lifecycle Status: Active; Minimum Order: 1; Number of Terminations: 2; Operating Temperature: -55°C ~ 170°C; Package / Case: 0603 (1608 Metric); Packaging: TapeAndReel; PartId: 4851; Part Status: Active; Price: 0.08; Ratings: AEC-Q200; Series: TLRZ; Size / Dimension: 0.063" L x 0.031" W (1.60mm x 0.80mm); Supplier 1: DigiKey; Supplier Part Number 1: 2019-TLRZ1JTTDCT-ND; Supplier Device Package: 0603; Tolerance: Jumper
R14 = ERA-3AEB222V: RES SMD 2.2K OHM 0.1% 1/10W 0603; Manufacturer: Panasonic Electronic Components; Power (Watts): 0.1W, 1/10W; Temperature Coefficient: ±25ppm/°C; Part Number: ERA-3AEB222V; Value: 2.2 kOhms; ComponentLink1Description: Datasheet; ComponentLink1URL: https://industrial.panasonic.com/cdbs/www-data/pdf/RDM0000/AOA0000C307.pdf; ComponentLink2Description: DigiKey Link; ComponentLink2URL: http://digikey.com/product-detail/en/panasonic-electronic-components/ERA-3AEB222V/P2.2KDBCT-ND/1466060; Composition: Thin Film; Device Package: 0603 (1608 Metric); Features: Automotive AEC-Q200; Height - Seated (Max): 0.022" (0.55mm); LastUpdated: 02.09.2020 1:10:23; Lifecycle Status: Active; Minimum Order: 1; Number of Terminations: 2; Operating Temperature: -55°C ~ 155°C; Package / Case: 0603 (1608 Metric); Packaging: TapeAndReel; PartId: 5547; Part Status: Active; Price: 0.04; Ratings: AEC-Q200; Resistance: 2.2 kOhms; Series: ERA-3A; Size / Dimension: 0.063" L x 0.031" W (1.60mm x 0.80mm); Supplier 1: DigiKey; Supplier Part Number 1: P2.2KDBCT-ND; Supplier Device Package: 0603; Tolerance: ±0.1%
U1 = CMP-0162-00111-1: 2K, 256x8 or 128x16-bit, 2.5V Microwire Serial EEPROM, 8-Pin SOIC 150mil, Industrial Temperature; ComponentAvailability: Unknown. Contact manufacturer to determine status.; PackageReference: SOIC-SN8; PackageVersion: revBB, Aug-2009; Code_IPC: SOIC127P600-8; PackageDescription: 8-Lead Plastic Small Outline (SN) - Narrow, 3.90mm Body [SOIC]; DatasheetVersion: revF, May-2008; Code_JEDEC: MS-012
X1 = CMP-0277-00003-1: Ceramic Surface Mount Low Profile Quartz Crystal, 8 MHz, -20 to 70 degC, 4-Pin 6 x 3.6 x 1.2 mm SMD, RoHS, 1000pcs / Reel; Manufacturer: Abracon; PartNumber: ABMM2-8.000MHZ-E2-T; ESR: 72 Ohm Max.; Frequency: 8 MHz; Shunt Capacitance C0: 7 pF Max.; Load Capacitance CL: 18 pF Typ.; ComponentLink3Description: Package Specification; PackageDescription: 4-Pin SMD, Body 6 x 3.6 mm, Pitch 4.4 mm; DatasheetVersion: Jan-13; ComponentLink1URL: http://www.abracon.com/; ComponentLink2URL: http://www.abracon.com/Resonators/ABMM2.pdf; Temperature Range: -20 to 70 degC; Mounting Technology: Surface Mount; RoHS: TRUE; ComponentLink2Description: Datasheet; ComponentLink3URL: http://www.abracon.com/Resonators/ABMM2.pdf; ComponentLink1Description: Manufacturer URL; Packing: 1000pcs / Reel

## Sheet fpga_peripherals.SchDoc: FPGA_PERIPHERALS
size A4
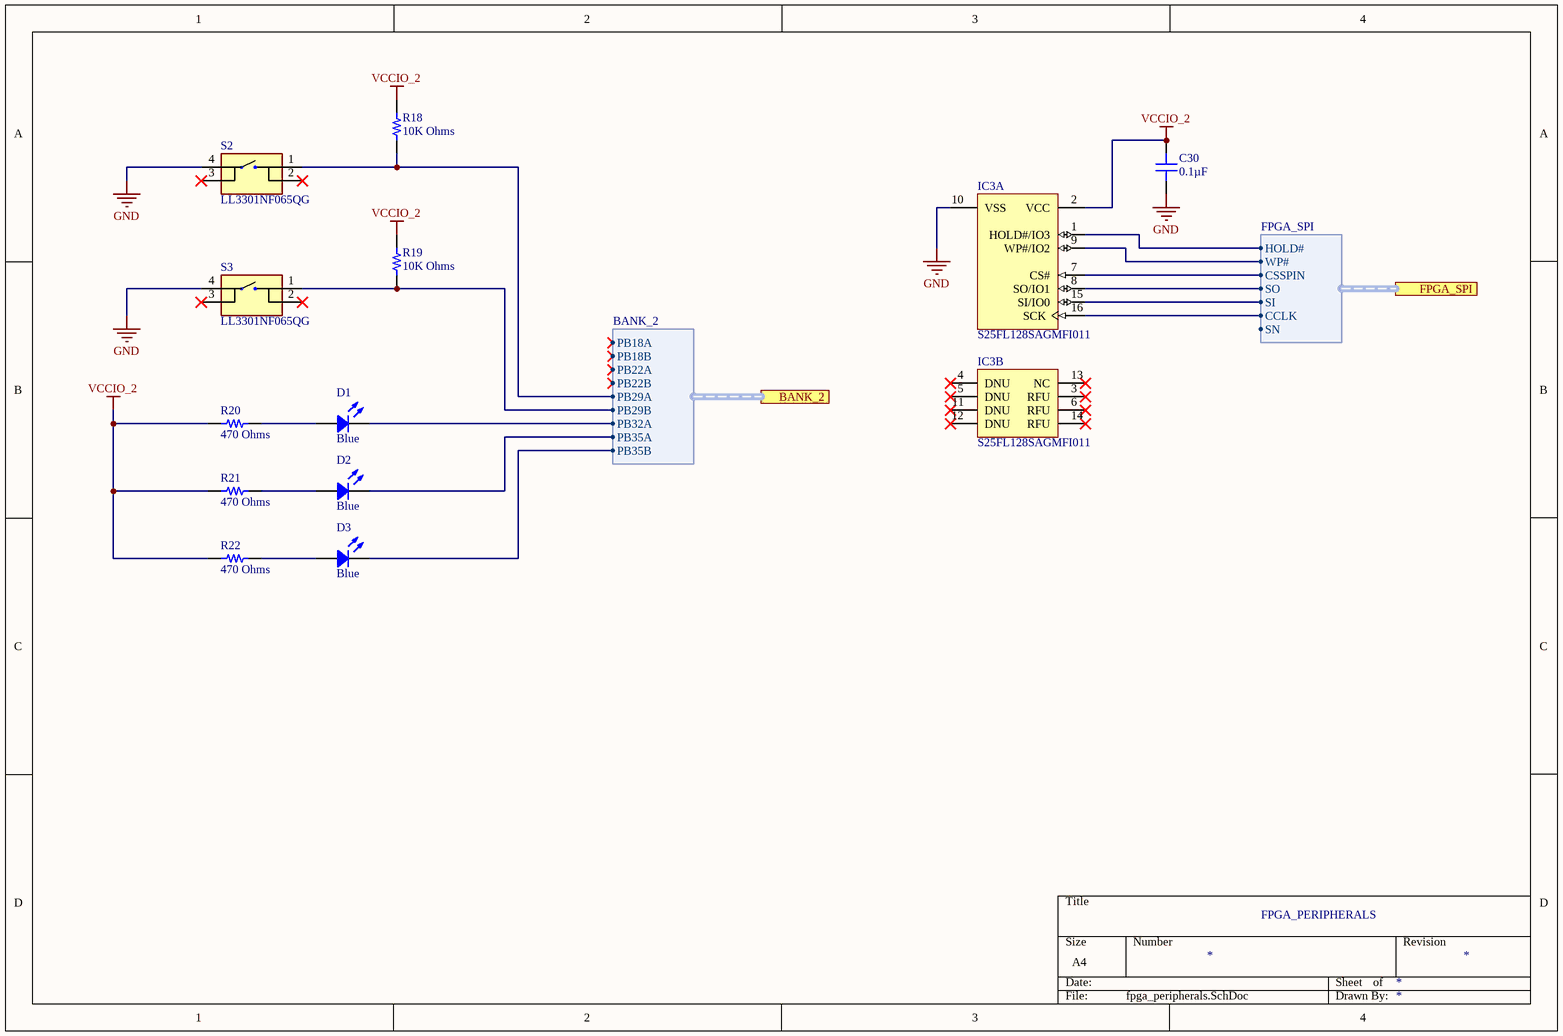
[diagram p4: fpga_peripherals.SchDoc]

### Parts
C30  0.1µF  [CAP 0603_1608]
D1  Blue  [LED 0603_1608 BLUE]
D2  Blue  [LED 0603_1608 BLUE]
D3  Blue  [LED 0603_1608 BLUE]
IC3  S25FL128SAGMFI011  [SPSN-SOIC-16_L]  (parts A,B of 2)
R18  10K Ohms  [RES 0603_1608]
R19  10K Ohms  [RES 0603_1608]
R20  470 Ohms  [RES 0603_1608]
R21  470 Ohms  [RES 0603_1608]
R22  470 Ohms  [RES 0603_1608]
S2  LL3301NF065QG  [LL3301NF065QG]
S3  LL3301NF065QG  [LL3301NF065QG]

### Ports
BANK_2 (harness BANK_2), FPGA_SPI (harness FPGA_SPI)

### Harnesses
FPGA_SPI: CCLK, CSSPIN, HOLD#, SI, SN, SO, WP#
BANK_2: PB18A, PB18B, PB22A, PB22B, PB29A, PB29B, PB32A, PB35A, PB35B

### Nets
GND: C30.1 IC3.10(VSS) S2.4 S3.4
VCCIO_2: C30.2 IC3.2(VCC) R18.2 R19.2 R20.1 R21.1 R22.1
CSSPIN: IC3.7(CS#) ; port FPGA_SPI.CSSPIN
PB29A: R18.1 S2.1 ; port BANK_2.PB29A
PB29B: R19.1 S3.1 ; port BANK_2.PB29B
PB32A: D1.2 ; port BANK_2.PB32A
PB35A: D2.2 ; port BANK_2.PB35A
PB35B: D3.2 ; port BANK_2.PB35B
NetD1_1: D1.1 R20.2
NetD2_1: D2.1 R21.2
NetD3_1: D3.1 R22.2
NetIC1_19: IC3.16(SCK) ; port FPGA_SPI.CCLK
NetIC1_20: IC3.8(SO/IO1) ; port FPGA_SPI.SO
NetIC1_33: IC3.9(WP#/IO2) ; port FPGA_SPI.WP#
NetIC1_34: IC3.1(HOLD#/IO3) ; port FPGA_SPI.HOLD#
NetIC1_36: IC3.15(SI/IO0) ; port FPGA_SPI.SI

Not connected (* = marked no-connect by the designer): IC3 3(RFU)* 4(DNU)* 5(DNU)* 6(RFU)* 11(DNU)* 12(DNU)* 13(NC)* 14(RFU)*; S2 2* 3*; S3 2* 3*

### Library data of the parts
C30 = C0603C104K5RAC7411: as C17 on sheet fpga_config; Part Number: C0603C104K5RAC7411; Value: 0.1µF; Applications: Bypass, Decoupling; Capacitance: 0.1µF; ComponentLink1Description: Datasheet; ComponentLink1URL: https://api.kemet.com/component-edge/download/datasheet/C0603C104K5RAC7411.pdf; ComponentLink2Description: DigiKey Link; ComponentLink2URL: http://digikey.com/product-detail/en/kemet/C0603C104K5RAC7411/399-7374-2-ND/3317013; Device Package: 0603 (1608 Metric); LastUpdated: 02.09.2020 1:03:36; Lifecycle Status: Active; Minimum Order: 15000; Mounting Type: Surface Mount, MLCC; Operating Temperature: -55°C ~ 125°C; Package / Case: 0603 (1608 Metric); Packaging: TapeAndReel; PartId: 2233; Part Status: Active; Price: 0.02; Series: SMD Comm X7R; Size / Dimension: 0.063" L x 0.031" W (1.60mm x 0.80mm); Supplier 1: DigiKey; Supplier Part Number 1: 399-7374-2-ND; Temperature Coefficient: X7R; Thickness (Max): 0.035" (0.90mm); Voltage - Rated: 50V
D1-D3 = VLMB1300-GS08: LED BLUE 0603 SMD; Manufacturer: Vishay Semiconductor Opto Division; Configuration: Standard; Current - Test: 20mA; Lens Color: 1.00mm; Lens Size: 1.10mm x 0.80mm; Lens Style: Rectangle with Flat Top; Millicandela Rating: 104mcd; Viewing Angle: 130°; Voltage - Forward (Vf) (Typ): 3.3V; Wavelength - Dominant: 470nm; Wavelength - Peak: 468nm; Part Number: VLMB1300-GS08; Color: Blue; ComponentLink1Description: Datasheet; ComponentLink1URL: http://www.vishay.com/docs/82437/vlmo1300.pdf; ComponentLink2Description: DigiKey Link; ComponentLink2URL: http://digikey.com/product-detail/en/vishay-semiconductor-opto-division/VLMB1300-GS08/VLMB1300-GS08CT-ND/3025485; Device Package: 0603 (1608 Metric); Height (Max): 1.00mm; LastUpdated: 02.09.2020 1:20:26; Lifecycle Status: Active; Minimum Order: 1; Mounting Type: Surface Mount; Package / Case: 0603 (1608 Metric); Packaging: TapeAndReel; PartId: 785; Part Status: Active; Price: 0.08; Series: CHIPLED; Size / Dimension: 1.60mm L x 0.80mm W; Supplier 1: DigiKey; Supplier Part Number 1: VLMB1300-GS08CT-ND; Supplier Device Package: 0603; Value: Blue
IC3 = CMP-1329-00018-1: MirrorBit Flash Non-Volatile Memory CMOS 3.0 Volt Core with Versatile I/O, Serial Peripheral Interface with Multi-I/O, 128 Mbit, 133 MHz, -40 to 85 degC, 16-Pin SO (SO3016), RoHS, Tube; Manufacturer: Spansion; OTP: 1024 B; VCC: 2.7 to 3.6 V; Speed: 133 MHz; PackageDescription: 16-Pin Wide Plastic Small Outline Package, Body 10.3 x 7.5 mm, Pitch 1.27 mm; Density: 128 Mbit; ComponentLink3URL: http://www.spansion.com/Support/Datasheets/S25FL128S_256S_00.pdf; DatasheetVersion: Rev. 08; ComponentLink2Description: Datasheet; ComponentLink3Description: Package Specification; PartNumber: S25FL128SAGMFI011; ComponentLink1Description: Manufacturer URL; ComponentLink1URL: http://www.spansion.com/Pages/Default.aspx; Mounting Technology: Surface Mount; Temperature Range: -40 to 85 degC; ComponentLink2URL: http://www.spansion.com/Support/Datasheets/S25FL128S_256S_00.pdf; RoHS: TRUE; Packing: Tube
R18 R19 = CRCW0603470RJNEAHP: as R1 on sheet fpga_core; Part Number: CRCW0603470RJNEAHP; Value: 10K Ohms; ComponentLink1Description: Datasheet; ComponentLink1URL: http://www.vishay.com/docs/20043/crcwhpe3.pdf; ComponentLink2Description: DigiKey Link; ComponentLink2URL: http://digikey.com/product-detail/en/vishay-dale/CRCW0603470RJNEAHP/541-470SACT-ND/2222809; Composition: Thick Film; Device Package: 0603 (1608 Metric); Features: Automotive AEC-Q200, Pulse Withstanding; Height - Seated (Max): 0.022" (0.55mm); LastUpdated: 02.09.2020 1:09:49; Lifecycle Status: Active; Minimum Order: 1; Number of Terminations: 2; Operating Temperature: -55°C ~ 155°C; Package / Case: 0603 (1608 Metric); Packaging: TapeAndReel; PartId: 21320; Part Status: Active; Price: 0.02; Ratings: AEC-Q200; Series: CRCW-HP; Size / Dimension: 0.063" L x 0.033" W (1.60mm x 0.85mm); Supplier Device Package: 0603; Tolerance: ±5%; Supplier 1: Farnell; Supplier Part Number 1: 3495224
R20-R22 = CRCW0603470RJNEAHP: RES SMD 470 OHM 5% 1/4W 0603; Manufacturer: Vishay Dale; Power (Watts): 0.25W, 1/4W; Temperature Coefficient: ±200ppm/°C; Part Number: CRCW0603470RJNEAHP; Value: 470 Ohms; ComponentLink1Description: Datasheet; ComponentLink1URL: http://www.vishay.com/docs/20043/crcwhpe3.pdf; ComponentLink2Description: DigiKey Link; ComponentLink2URL: http://digikey.com/product-detail/en/vishay-dale/CRCW0603470RJNEAHP/541-470SACT-ND/2222809; Composition: Thick Film; Device Package: 0603 (1608 Metric); Features: Automotive AEC-Q200, Pulse Withstanding; Height - Seated (Max): 0.022" (0.55mm); LastUpdated: 02.09.2020 1:09:49; Lifecycle Status: Active; Minimum Order: 1; Number of Terminations: 2; Operating Temperature: -55°C ~ 155°C; Package / Case: 0603 (1608 Metric); Packaging: TapeAndReel; PartId: 21320; Part Status: Active; Price: 0.02; Ratings: AEC-Q200; Resistance: 470 Ohms; Series: CRCW-HP; Size / Dimension: 0.063" L x 0.033" W (1.60mm x 0.85mm); Supplier 1: DigiKey; Supplier Part Number 1: 541-470SACT-ND; Supplier Device Package: 0603; Tolerance: ±5%
S2 S3 = LL3301NF065QG: Switch; Manufacturer_Name: E-Switch; Datasheet Link: http://spec_sheets.e-switch.com/specs/P090002.pdf; Height: 4mm; Manufacturer_Part_Number: LL3301NF065QG; Mouser Part Number: 612-LL3301NF065QG; Mouser Price/Stock: https://www.mouser.co.uk/ProductDetail/E-Switch/LL3301NF065QG/?qs=QtyuwXswaQiWhwgY68YTTw%3D%3D

## Sheet fpga_headers.SchDoc
size A4
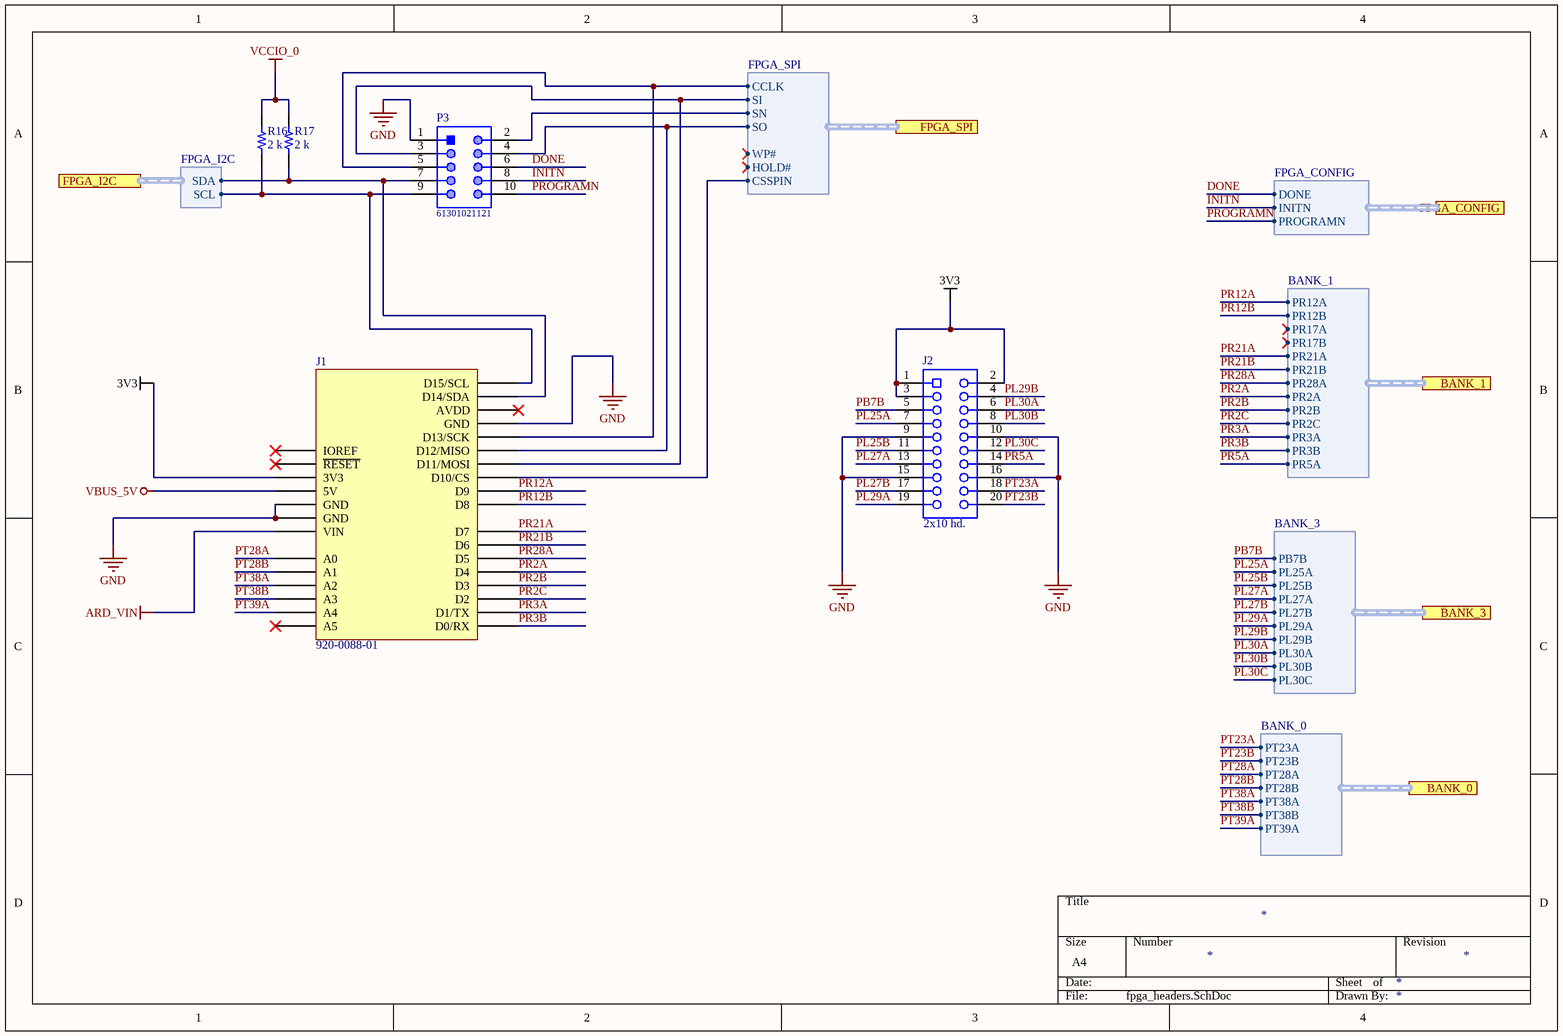
[diagram p5: fpga_headers.SchDoc]

### Parts
J1  920-0088-01  [SCHMARTBOARD - 920-0088-01]
J2  2x10 hd.  [SLIN-PPPC102LFBN-RC_V]
P3  61301021121  [61301021121]
R16  2 k  [RES 0603_1608]
R17  2 k  [RES 0603_1608]

### Ports
BANK_0 (harness BANK_0), BANK_1 (harness BANK_1), BANK_3 (harness BANK_3), FPGA_CONFIG (harness FPGA_CONFIG), FPGA_I2C (harness FPGA_I2C), FPGA_SPI (harness FPGA_SPI)

### Harnesses
FPGA_I2C: SCL, SDA
BANK_1: PR12A, PR12B, PR17A, PR17B, PR21A, PR21B, PR28A, PR2A, PR2B, PR2C, PR3A, PR3B, PR5A
BANK_3: PB7B, PL25A, PL25B, PL27A, PL27B, PL29A, PL29B, PL30A, PL30B, PL30C
FPGA_CONFIG: DONE, INITN, PROGRAMN
FPGA_SPI: CCLK, CSSPIN, HOLD#, SI, SN, SO, WP#
BANK_0: PT23A, PT23B, PT28A, PT28B, PT38A, PT38B, PT39A

### Nets
3V3: J1.4(3V3) J2.1 J2.2 J2.3
ARD_VIN: J1.8(VIN)
GND: J1.6(GND) J1.7(GND) J1.29(GND) J2.9 J2.10 J2.15 J2.16 P3.1
VBUS_5V: J1.5(5V)
VCCIO_0: R16.2 R17.2
CSSPIN: J1.25(D10/CS) ; port FPGA_SPI.CSSPIN
DONE: P3.6 ; port FPGA_CONFIG.DONE
INITN: P3.8 ; port FPGA_CONFIG.INITN
PB7B: J2.5 ; port BANK_3.PB7B
PL25A: J2.7 ; port BANK_3.PL25A
PL25B: J2.11 ; port BANK_3.PL25B
PL27A: J2.13 ; port BANK_3.PL27A
PL27B: J2.17 ; port BANK_3.PL27B
PL29A: J2.19 ; port BANK_3.PL29A
PL29B: J2.4 ; port BANK_3.PL29B
PL30A: J2.6 ; port BANK_3.PL30A
PL30B: J2.8 ; port BANK_3.PL30B
PL30C: J2.12 ; port BANK_3.PL30C
PR2A: J1.19(D4) ; port BANK_1.PR2A
PR2B: J1.18(D3) ; port BANK_1.PR2B
PR2C: J1.17(D2) ; port BANK_1.PR2C
PR3A: J1.16(D1/TX) ; port BANK_1.PR3A
PR3B: J1.15(D0/RX) ; port BANK_1.PR3B
PR5A: J2.14 ; port BANK_1.PR5A
PR12A: J1.24(D9) ; port BANK_1.PR12A
PR12B: J1.23(D8) ; port BANK_1.PR12B
PR21A: J1.22(D7) ; port BANK_1.PR21A
PR21B: J1.21(D6) ; port BANK_1.PR21B
PR28A: J1.20(D5) ; port BANK_1.PR28A
PROGRAMN: P3.10 ; port FPGA_CONFIG.PROGRAMN  [project net PROGN]
PT23A: J2.18 ; port BANK_0.PT23A
PT23B: J2.20 ; port BANK_0.PT23B
PT28A: J1.9(A0) ; port BANK_0.PT28A
PT28B: J1.10(A1) ; port BANK_0.PT28B
PT38A: J1.11(A2) ; port BANK_0.PT38A
PT38B: J1.12(A3) ; port BANK_0.PT38B
PT39A: J1.13(A4) ; port BANK_0.PT39A
NetIC1_19: J1.28(D13/SCK) P3.5 ; port FPGA_SPI.CCLK
NetIC1_20: J1.27(D12/MISO) P3.4 ; port FPGA_SPI.SO
NetIC1_35: P3.2 ; port FPGA_SPI.SN
NetIC1_36: J1.26(D11/MOSI) P3.3 ; port FPGA_SPI.SI
NetIC1_66: J1.31(D14/SDA) P3.7 R17.1 ; port FPGA_I2C.SDA
NetIC1_67: J1.32(D15/SCL) P3.9 R16.1 ; port FPGA_I2C.SCL

Not connected (* = marked no-connect by the designer): J1 2(IOREF)* 3(~{RESET})* 14(A5)* 30(AVDD)*

### Library data of the parts
J1 = 920-0088-01: CONN HDR 8/10P 0.1 GOLD PCB 6PC; Manufacturer: Schmartboard, Inc.; Connector Type: Header; Contact Length - Post: 0.413" (10.50mm); Number of Positions: 6, 8, 10; Number of Positions Loaded: All; Pitch - Mating: 0.100" (2.54mm); Style: Board to Board; Part Number: 920-0088-01; ComponentLink1Description: Datasheet; ComponentLink1URL: http://schmartboard.com/content/Brochures/920-0088-01.pdf; ComponentLink2Description: DigiKey Link; ComponentLink2URL: http://digikey.com/product-detail/en/schmartboard-inc/920-0088-01/1988-1036-ND/9559319; Contact Finish - Mating: Gold; Contact Finish - Post: Gold; Contact Type: Female Socket; Fastening Type: Push-Pull; Insulation Color: Black; Insulation Height: 0.335" (8.51mm); LastUpdated: 31.01.2020 20:49:58; Lifecycle Status: Active; Minimum Order: 1; Mounting Type: Through Hole; Number of Rows: 1; Packaging: Bulk; Part Status: Active; Price: 5.00; Series: -; Supplier 1: DigiKey; Supplier Part Number 1: 1988-1036-ND; Termination: Solder
J2 = CMP-1770-00003-1: Female Header, Pitch 2.54 mm, 2 x 10 Position, Height 8.75 mm, Tail Length 3.2 mm, -40 to 105 degC, RoHS, Bulk; Max Supply Voltage: 16 V; Frequency: 100 KHz; Case\Package: SOIC; Min Supply Voltage: 4.5 V; Max Ouput Current: -200 mA; Package Quantity: 2500; ComponentLink1Description: Datasheet; Min Operating Temperature: 0 degC; Pins: 8; Weight: 0.002561 oz; Radiation Hardening: No; Mount: Surface Mount; Width: 3.91 mm; RoHSCompliant: true; ComponentLink1URL: http://datasheet.octopart.com/PPPC102LFBN-RC-Sullins-datasheet-8327184.pdf; DatasheetVersion: Rev. D, 10/2007; Max Operating Temperature: 70 degC; Height: 1.58 mm; Length: 4.9 mm; PackageReference: PPPC102LFBN-RC; Packaging: Tape and Reel; REACH SVHC: No SVHC; PackageDescription: Female Header, Pitch 2.54 mm, 2 x 10 Position, Height 8.75 mm, Tail Length 3.2 mm
P3 = CMP-1502-01084-1: as P2 on sheet fpga_config; Operating Temperature: -40to105degC; Mounting Technology: THT; Publisher: WurthElektronik; Manufacturer URL: http://www.we-online.de; Part Number: 61301021121; Row Number: Dual; Packaging: Bag; Orientation: Vertical; Package Reference: 61301021121; Datasheet URL: https://katalog.we-online.de/em/datasheet/6130xx21121.pdf
R16 R17 = RMCF0603JT2K00: RES 2K OHM 5% 1/10W 0603; Manufacturer: Stackpole Electronics Inc; Power (Watts): 0.1W, 1/10W; Resistance: 2 kOhms; Temperature Coefficient: ±200ppm/°C; Part Number: RMCF0603JT2K00; Value: 2 k; ComponentLink1Description: Datasheet; ComponentLink1URL: https://www.seielect.com/catalog/sei-rmcf_rmcp.pdf; ComponentLink2Description: DigiKey Link; ComponentLink2URL: http://digikey.com/product-detail/en/stackpole-electronics-inc/RMCF0603JT2K00/RMCF0603JT2K00CT-ND/1943177; Composition: Thick Film; Device Package: 0603 (1608 Metric); Features: Automotive AEC-Q200; Height - Seated (Max): 0.022" (0.55mm); LastUpdated: 02.09.2020 1:10:22; Lifecycle Status: Active; Minimum Order: 1; Number of Terminations: 2; Operating Temperature: -55°C ~ 155°C; Package / Case: 0603 (1608 Metric); Packaging: CutTape; PartId: 5994; Part Status: Active; Price: 0.10; Ratings: AEC-Q200; Series: RMCF; Size / Dimension: 0.061" L x 0.031" W (1.55mm x 0.80mm); Supplier 1: DigiKey; Supplier Part Number 1: RMCF0603JT2K00CT-ND; Supplier Device Package: 0603; Tolerance: ±5%

## Nets that join several sheets
3V3: fpga_power (7 pins), fpga_config (19 pins), fpga_headers (J1.4 J2.1 J2.2 J2.3)
ARD_VIN: fpga_power (J5.2), fpga_headers (J1.8)
GND: fpga_core (17 pins), fpga_power (C31.1 C32.2 U2.1), fpga_config (40 pins), fpga_peripherals (C30.1 IC3.10 S2.4 S3.4), fpga_headers (8 pins)
VBUS_5V: fpga_power (C31.2 J5.1 U2.3), fpga_config (P1.1), fpga_headers (J1.5)
VCCIO_0: fpga_core (8 pins), fpga_power (J3.2), fpga_config (5 pins), fpga_headers (R16.2 R17.2)
VCCIO_1: fpga_core (7 pins), fpga_power (J4.2)
VCCIO_2: fpga_core (7 pins), fpga_power (J6.2), fpga_peripherals (7 pins)
VCCIO_3: fpga_core (C9.2 C10.2 IC1.15), fpga_power (J7.2)
VCCIO_CORE: fpga_core (IC1.5 IC1.29 IC1.46), fpga_power (J8.2)
CSSPIN: fpga_core (IC1.16), fpga_peripherals (IC3.7), fpga_headers (J1.25)
DONE: fpga_core (IC1.54), fpga_headers (P3.6)
INITN: fpga_core (IC1.55), fpga_headers (P3.8)
NetIC1_1: fpga_core (IC1.1), fpga_config (IC2.17 P2.8 R5.1)
NetIC1_2: fpga_core (IC1.2), fpga_config (IC2.18 P2.6 R6.1)
NetIC1_19: fpga_core (IC1.19), fpga_peripherals (IC3.16), fpga_headers (J1.28 P3.5)
NetIC1_20: fpga_core (IC1.20), fpga_peripherals (IC3.8), fpga_headers (J1.27 P3.4)
NetIC1_33: fpga_core (IC1.33), fpga_peripherals (IC3.9)
NetIC1_34: fpga_core (IC1.34), fpga_peripherals (IC3.1)
NetIC1_35: fpga_core (IC1.35), fpga_headers (P3.2)
NetIC1_36: fpga_core (IC1.36), fpga_peripherals (IC3.15), fpga_headers (J1.26 P3.3)
NetIC1_62: fpga_core (IC1.62), fpga_config (P2.10 R8.1)
NetIC1_66: fpga_core (IC1.66), fpga_config (R12.2 R13.2), fpga_headers (J1.31 P3.7 R17.1)
NetIC1_67: fpga_core (IC1.67), fpga_config (R11.2), fpga_headers (J1.32 P3.9 R16.1)
NetIC1_70: fpga_core (IC1.70), fpga_config (IC2.19 P2.2 R7.1)
NetIC1_71: fpga_core (IC1.71), fpga_config (IC2.16 P2.4 R10.2)
PB7B: fpga_core (IC1.17), fpga_headers (J2.5)
PB29A: fpga_core (IC1.26), fpga_peripherals (R18.1 S2.1)
PB29B: fpga_core (IC1.27), fpga_peripherals (R19.1 S3.1)
PB32A: fpga_core (IC1.28), fpga_peripherals (D1.2)
PB35A: fpga_core (IC1.30), fpga_peripherals (D2.2)
PB35B: fpga_core (IC1.31), fpga_peripherals (D3.2)
PL25A: fpga_core (IC1.6), fpga_headers (J2.7)
PL25B: fpga_core (IC1.7), fpga_headers (J2.11)
PL27A: fpga_core (IC1.8), fpga_headers (J2.13)
PL27B: fpga_core (IC1.9), fpga_headers (J2.17)
PL29A: fpga_core (IC1.10), fpga_headers (J2.19)
PL29B: fpga_core (IC1.11), fpga_headers (J2.4)
PL30A: fpga_core (IC1.12), fpga_headers (J2.6)
PL30B: fpga_core (IC1.13), fpga_headers (J2.8)
PL30C: fpga_core (IC1.14), fpga_headers (J2.12)
PR2A: fpga_core (IC1.53), fpga_headers (J1.19)
PR2B: fpga_core (IC1.52), fpga_headers (J1.18)
PR2C: fpga_core (IC1.51), fpga_headers (J1.17)
PR3A: fpga_core (IC1.50), fpga_headers (J1.16)
PR3B: fpga_core (IC1.49), fpga_headers (J1.15)
PR5A: fpga_core (IC1.47), fpga_headers (J2.14)
PR12A: fpga_core (IC1.45), fpga_headers (J1.24)
PR12B: fpga_core (IC1.44), fpga_headers (J1.23)
PR21A: fpga_core (IC1.40), fpga_headers (J1.22)
PR21B: fpga_core (IC1.38), fpga_headers (J1.21)
PR28A: fpga_core (IC1.37), fpga_headers (J1.20)
PROGN: fpga_core (IC1.61), fpga_headers (P3.10)
PT23A: fpga_core (IC1.69), fpga_config (C22.2 IC2.3 X1.1), fpga_headers (J2.18)
PT23B: fpga_core (IC1.68), fpga_headers (J2.20)
PT28A: fpga_core (IC1.65), fpga_headers (J1.9)
PT28B: fpga_core (IC1.63), fpga_headers (J1.10)
PT38A: fpga_core (IC1.59), fpga_headers (J1.11)
PT38B: fpga_core (IC1.58), fpga_headers (J1.12)
PT39A: fpga_core (IC1.57), fpga_headers (J1.13)